# EAGLE design SOT23-5 (EAGLE 7.3.0)
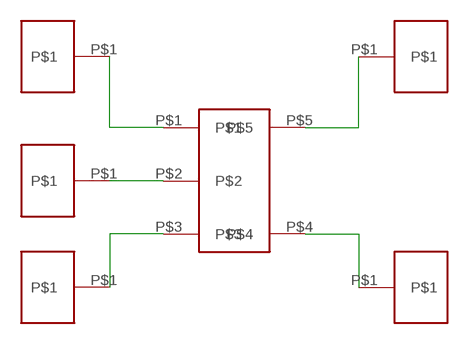
[diagram p0: schematic, sheet 1]

## Parts
U$1  SOT23-5  [SOT23-5]
U$2  PAD  [100MIL_PAD]
U$3  PAD  [100MIL_PAD]
U$4  PAD  [100MIL_PAD]
U$5  PAD  [100MIL_PAD]
U$6  PAD  [100MIL_PAD]

## Nets
N$1: U$1.P$2 U$2.P$1
N$2: U$1.P$1 U$3.P$1
N$3: U$1.P$3 U$4.P$1
N$4: U$1.P$4 U$5.P$1
N$5: U$1.P$5 U$6.P$1

## Library data of the parts
U$1 = generic_smd:SOT23-5
U$2-U$6 = generic_smd:PAD

## Board
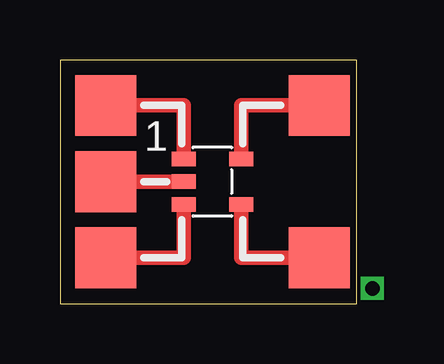
[diagram p1: board, top side]
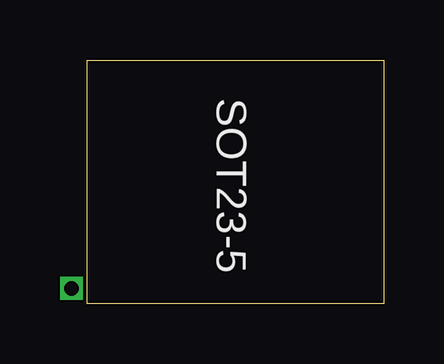
[diagram p2: board, bottom side, seen from below]

Size 12.37 x 10.15 mm. Coordinates in mm from the lower left corner, seen from the top.
Outline: 0,0 12.37,0 12.37,10.15 0,10.15 0,0
Copper layers (1*16): Top 0.0356mm / dielectric 1.5011mm / Bottom 0.0356mm
Design rules "LaenPCBOrder": minimum track width 6mil, minimum drill 13mil, track to track 6mil, track to pad 6mil, pad to pad 6mil, via to via 6mil, smd to smd 6mil, copper to edge 15mil, drill to drill 6mil, minimum pad ring 7mil, minimum via ring 7mil, stop-mask expansion 3mil, vias tented up to drill 0mil, thermal gap 10mil

### Footprints (pad centres in the part's own frame; a part is rotated, then mirrored left to right if it is on the bottom)
SOT23-5 = smd 0.6 x 1: P$1 -0.95,-1.2; P$2 0,-1.2; P$3 0.95,-1.2; P$4 0.95,1.2; P$5 -0.95,1.2
100MIL_PAD = smd 2.54 x 2.54: P$1 0,0

### Placement (x,y rotation side)
U$1  6.35,5.08 270 top
U$2  1.91,5.08 0 top
U$3  1.91,8.26 0 top
U$4  1.91,1.91 0 top
U$5  10.79,1.91 0 top
U$6  10.79,8.26 0 top

### Tracks (layer width: path | path; a pad name or v marks a point on that pad's centre or on a via)
N$1
  Top 0.61: U$1.P$2 U$2.P$1
N$2
  Top 0.61: U$1.P$1 5.15,8.26 U$3.P$1
N$3
  Top 0.61: U$1.P$3 5.15,1.91 U$4.P$1
N$4
  Top 0.61: U$1.P$4 7.55,1.91 U$5.P$1
N$5
  Top 0.61: U$1.P$5 7.55,8.26 U$6.P$1
N$6  (via drill 0.6)
  other vias: 13.02,0.64

### Text on the board
tPlace: 1
bPlace: SOT23-5
Document: via required to force drill file generation